# Altium project MB1280.PrjPCB
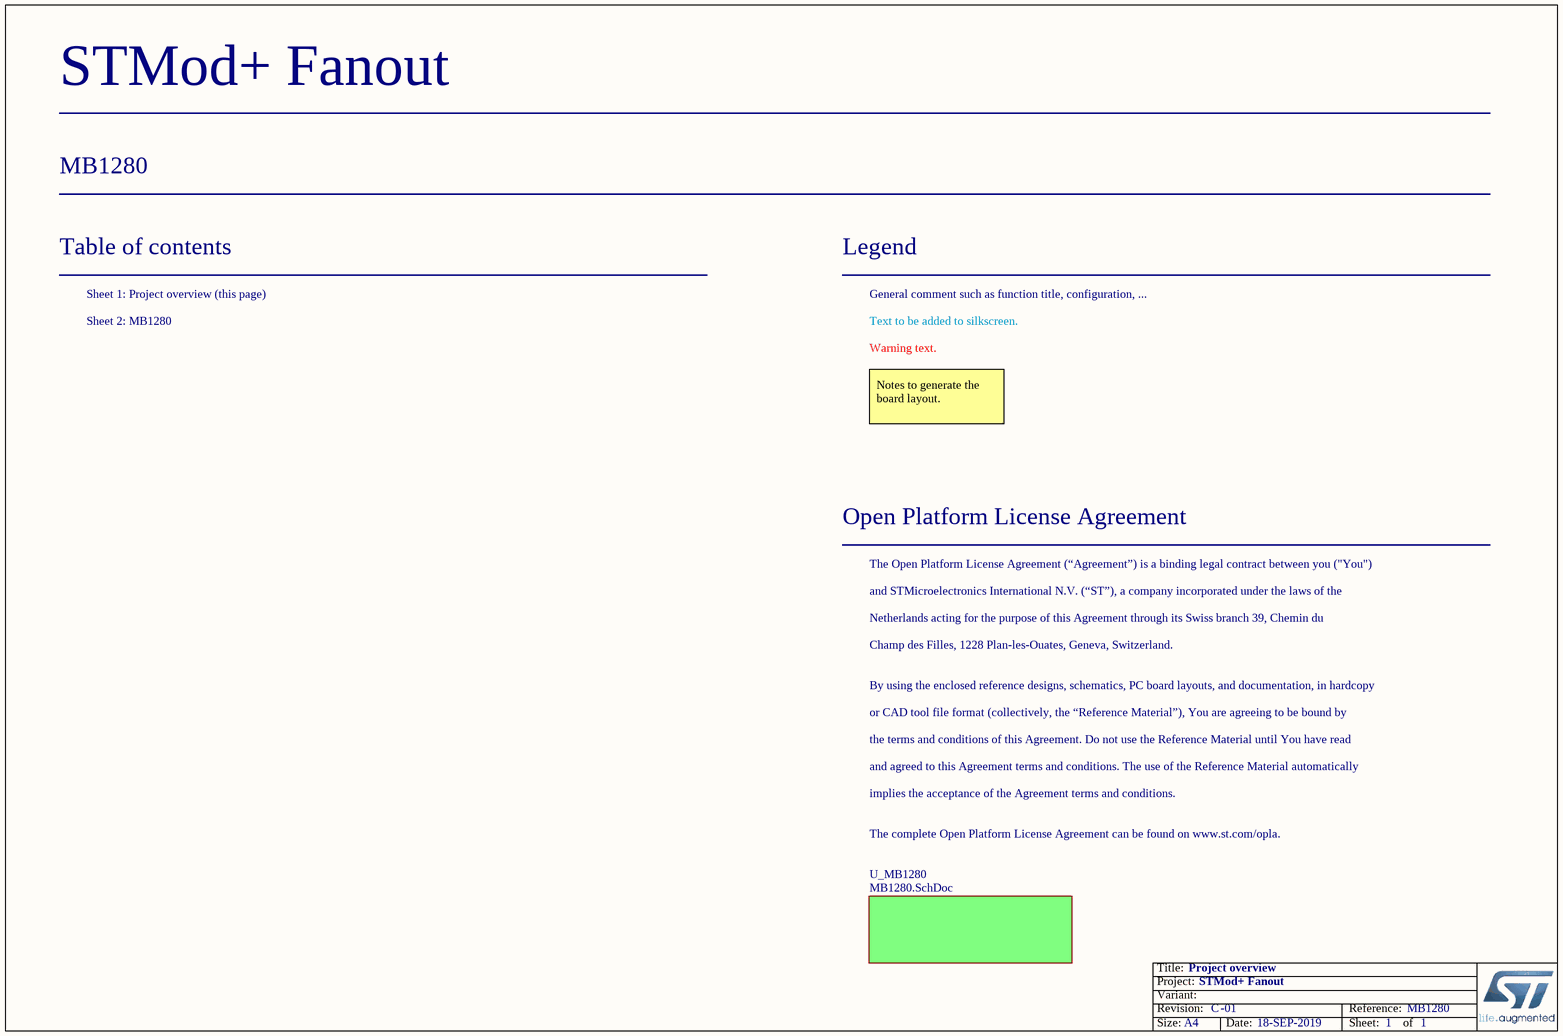
[diagram p0: Project_Overview.SchDoc]
Board_Assembly_Revision: 01; Board_Document_Date: 18-SEP-2019; Board_Name: STMod+ Fanout; Board_PCB_Revision: C; Board_Reference: MB1280
2 sheets, 28 parts. Net scope: global (net labels, ports and power ports of the same name join across sheets).
Board file: MB1280.PcbDoc
Sheets:
  Project_Overview.SchDoc
    U_MB1280 = MB1280.SchDoc

## Sheet Project_Overview.SchDoc: Project overview
size A4; Date: Not used; ApprovedBy: Not used; CheckedBy: Not used; Author: Not used; CompanyName: STMicroelectronics; DrawnBy: Not used; Engineer: Not used; Organization: Not used; Address1: Not used; Address2: Not used; Address3: Not used; Address4: Not used; DocumentNumber: Not used; Revision: Not used; SheetNumber: 1; SheetTotal: 1; CurrentTime: Not used; CurrentDate: Not used; Time: Not used; DocumentFullPathAndName: Not used; DocumentName: Not used; ModifiedDate: Not used; ImagePath: Not used; ProjectName: Not used; Application_BuildNumber: Not used

### Sub-sheets
U_MB1280 = MB1280.SchDoc: no entries

### Notes on the sheet
- Table of contents
- Sheet 1: Project overview (this page)
- Legend
- General comment such as function title, configuration, ...
- Sheet 2: MB1280
- Text to be added to silkscreen.
- Warning text.
- Notes to generate the board layout.
- Open Platform License Agreement
- The Open Platform License Agreement (“Agreement”) is a binding legal contract between you ("You")
- and STMicroelectronics International N.V. (“ST”), a company incorporated under the laws of the
- Netherlands acting for the purpose of this Agreement through its Swiss branch 39, Chemin du
- Champ des Filles, 1228 Plan-les-Ouates, Geneva, Switzerland.
- By using the enclosed reference designs, schematics, PC board layouts, and documentation, in hardcopy
- or CAD tool file format (collectively, the “Reference Material”), You are agreeing to be bound by
- the terms and conditions of this Agreement. Do not use the Reference Material until You have read
- and agreed to this Agreement terms and conditions. The use of the Reference Material automatically
- implies the acceptance of the Agreement terms and conditions.
- The complete Open Platform License Agreement can be found on www.st.com/opla.
- Title:
- Project:
- Size:
- Revision:
- Variant:
- A4
- -
- Date:
- Reference:
- Sheet:
- of

## Sheet MB1280.SchDoc: MB1280
size A4; Project: STM32H7-DK-DB; Date: Not used; ApprovedBy: Not used; CheckedBy: Not used; Author: Not used; CompanyName: STMicroelectronics; DrawnBy: Not used; Engineer: Not used; Organization: Not used; Address1: Not used; Address2: Not used; Address3: Not used; Address4: Not used; DocumentNumber: Not used; Revision: Not used; SheetNumber: 1; SheetTotal: 1; CurrentTime: Not used; CurrentDate: Not used; Time: Not used; DocumentFullPathAndName: Not used; DocumentName: Not used; ModifiedDate: Not used; ImagePath: Not used; ProjectName: Not used; Application_BuildNumber: Not used
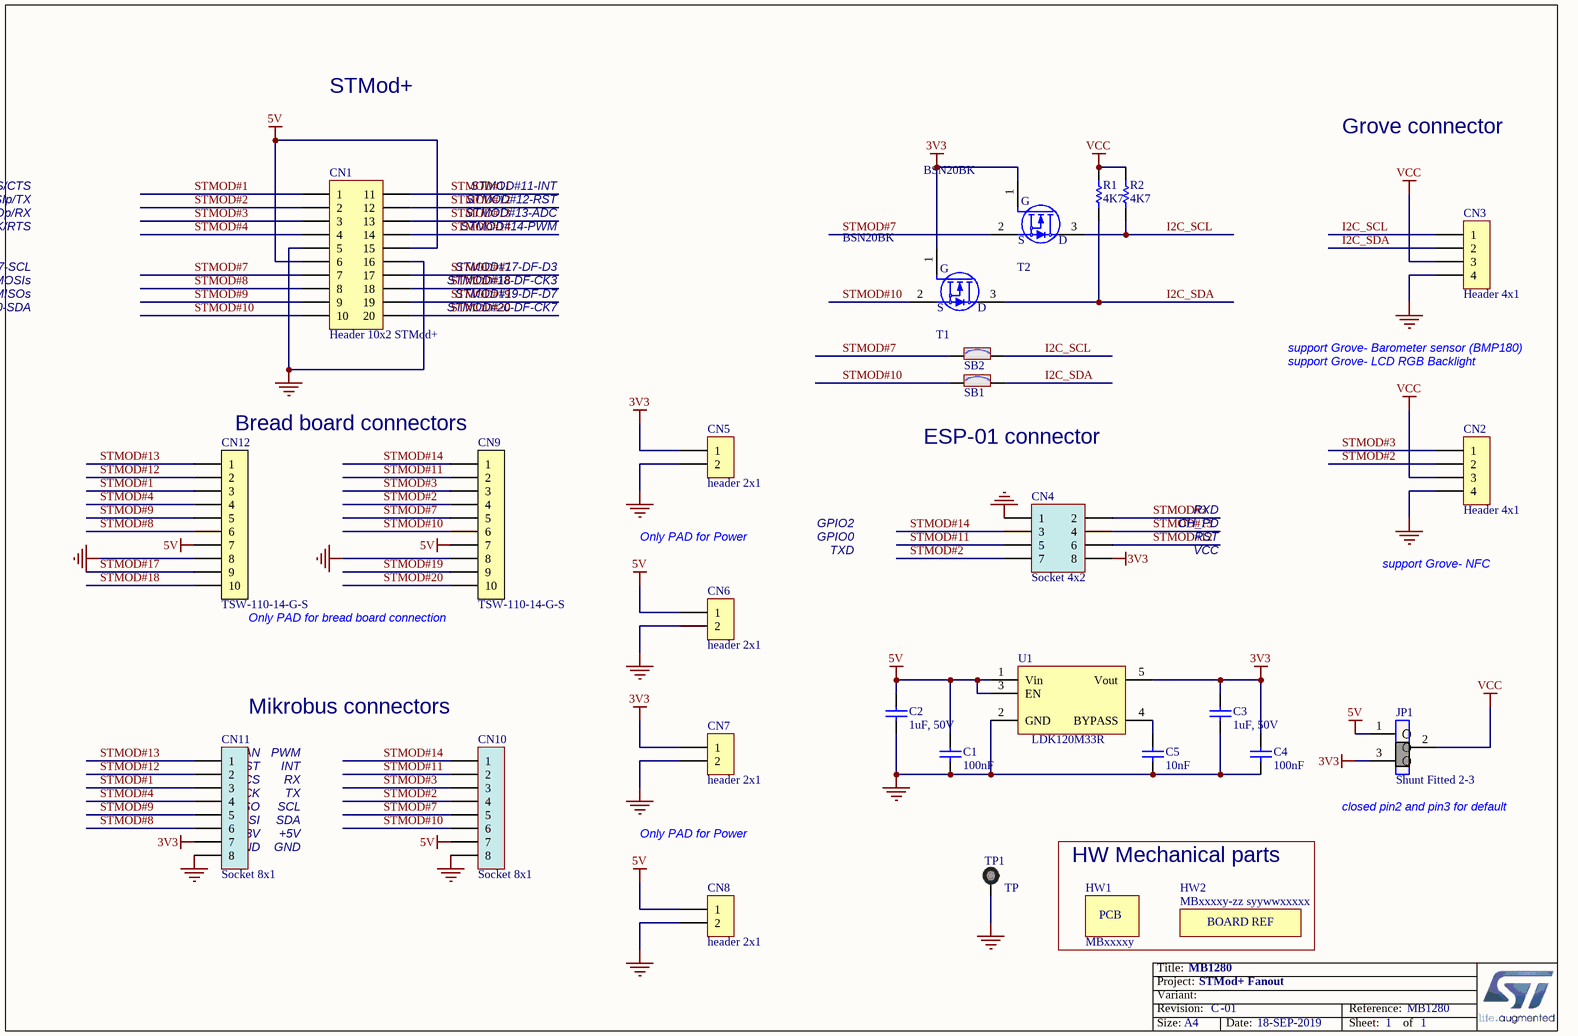
[diagram p1: MB1280.SchDoc]

### Parts
C1  value 100nF  [C0603]  (hidden comment: Capacitor)
C2  value 1uF, 50V  [C0603_H0P8]  (hidden comment: Capacitor)
C3  value 1uF, 50V  [C0603_H0P8]  (hidden comment: Capacitor)
C4  value 100nF  [C0603]  (hidden comment: Capacitor)
C5  value 10nF  [C0603]  (hidden comment: Capacitor)
CN1  Header 10x2 STMod+  [CON_SAMTEC_TMM-110-01-L-D-RA__STMOD+]
CN2  Header 4x1  [CON_988-JIUBABA_A2006LF-04A]
CN3  Header 4x1  [CON_988-JIUBABA_A2006LF-04A]
CN4  Socket 4x2  [CON_SAMTEC_SSW-104-01-X-D]
CN5  Header 2x1  [CON_988-JIUBABA_PHFS25-11-02-G0B115-T-1]
CN6  Header 2x1  [CON_988-JIUBABA_PHFS25-11-02-G0B115-T-1]
CN7  Header 2x1  [CON_988-JIUBABA_PHFS25-11-02-G0B115-T-1]
CN8  Header 2x1  [CON_988-JIUBABA_PHFS25-11-02-G0B115-T-1]
CN9  value TSW-110-14-G-S  [CON_SAMTEC_TSW-110-14-G-S]  (hidden comment: Header 10x1)
CN10  Socket 8x1  [CON_SAMTEC_SSW-108-01-X-S]
CN11  Socket 8x1  [CON_SAMTEC_SSW-108-01-X-S]
CN12  value TSW-110-14-G-S  [CON_SAMTEC_TSW-110-14-G-S]  (hidden comment: Header 10x1)
HW1  value MBxxxxy  (hidden comment: PCB)  (mechanical)
HW2  value MBxxxxy-zz syywwxxxxx  [STICKER_25X9]  (hidden comment: STICKER_BOARD_REF)  (no BOM)
JP1  value Shunt Fitted 2-3  [CON_SAMTEC_TSW-103-07-F-S]  (hidden comment: Jumper_Header 3x1 Fitted 2-3)
R1  value 4K7  [R0603]  (hidden comment: Resistor)
R2  value 4K7  [R0603]  (hidden comment: Resistor)
SB1  SB_ON  [SOLDER-BRIDGE_R0603-0R]  (value not drawn)
SB2  SB_ON  [SOLDER-BRIDGE_R0603-0R]  (value not drawn)
T1  value BSN20BK  [MOS_SOT23]  (hidden comment: BSN20)
T2  value BSN20BK  [MOS_SOT23]  (hidden comment: BSN20)
TP1  value TP  [TP_PTH_1MM_2MM]  (hidden comment: Test_Point_PTH_1mm_2mm)  (no BOM)
U1  LDK120M33R  [REG_SOT23-5L]

### Blocks framed on the sheet
HW Mechanical parts: HW1 HW2

### Nets
3V3: C3.2 C4.2 CN4.8 CN5.1 CN7.1 CN11.7 JP1.3 T1.1(G) T2.1(G) U1.5(Vout)
5V: C1.2 C2.2 CN1.6 CN1.15 CN6.1 CN8.1 CN9.7 CN10.7 CN12.7 JP1.1 U1.1(Vin) U1.3(EN)
GND: C1.1 C2.1 C3.1 C4.1 C5.1 CN1.5 CN1.16 CN2.4 CN3.4 CN4.1 CN5.2 CN6.2 CN7.2 CN8.2 CN9.8 CN10.8 CN11.8 CN12.8 TP1.1 U1.2(GND)
VCC: CN2.3 CN3.3 JP1.2 R1.1 R2.1
I2C_SCL: CN3.1 R2.2 SB2.2 T2.3(D)
I2C_SDA: CN3.2 R1.2 SB1.2 T1.3(D)
STMOD#1: CN1.1 CN11.3 CN12.3
STMOD#2: CN1.2 CN2.2 CN4.7 CN9.4 CN10.4
STMOD#3: CN1.3 CN2.1 CN4.2 CN9.3 CN10.3
STMOD#4: CN1.4 CN11.4 CN12.4
STMOD#7: CN1.7 CN9.5 CN10.5 SB2.1 T2.2(S)
STMOD#8: CN1.8 CN11.6 CN12.6
STMOD#9: CN1.9 CN11.5 CN12.5
STMOD#10: CN1.10 CN9.6 CN10.6 SB1.1 T1.2(S)
STMOD#11: CN1.11 CN4.5 CN9.2 CN10.2
STMOD#12: CN1.12 CN4.6 CN11.2 CN12.2
STMOD#13: CN1.13 CN4.4 CN11.1 CN12.1
STMOD#14: CN1.14 CN4.3 CN9.1 CN10.1
STMOD#17: CN1.17 CN12.9
STMOD#18: CN1.18 CN12.10
STMOD#19: CN1.19 CN9.9
STMOD#20: CN1.20 CN9.10
NetC5_2: C5.2 U1.4(BYPASS)

### Notes on the sheet
- STMod+
- Grove connector
- STMOD#1-NSS/CTS
- STMOD#2-MOSIp/TX
- STMOD#3-MISOp/RX
- STMOD#4-SCK/RTS
- STMOD#11-INT
- STMOD#12-RST
- STMOD#13-ADC
- STMOD#14-PWM
- (near CN3) SCL
- (near CN3) SDA
- STMOD#7-SCL
- STMOD#8-MOSIs
- STMOD#9-MISOs
- STMOD#10-SDA
- STMOD#17-DF-D3
- STMOD#18-DF-CK3
- STMOD#19-DF-D7
- STMOD#20-DF-CK7
- support Grove- Barometer sensor (BMP180)
- support Grove- LCD RGB Backlight
- Bread board connectors
- ESP-01 connector
- (near CN2) RX
- RXD
- (near CN2) TX
- Only PAD for Power
- GPIO2
- GPIO0
- TXD
- CH_PD
- RST
- VCC
- support Grove- NFC
- Only PAD for bread board connection
- Mikrobus connectors
- (near CN11) AN
- (near CN11) RST
- (near CN11) CS
- PWM
- INT
- RX
- (near CN11) SCK
- (near CN11) MISO
- (near CN11) MOSI
- (near CN11) +3.3V
- (near CN11) GND
- TX
- SCL
- SDA
- +5V
- GND
- (near JP1) closed pin2 and pin3 for default
- Title:
- Project:
- Size:
- Revision:
- Variant:
- A4
- -
- Date:
- Reference:
- Sheet:
- of
- (in symbol MCD-00235) BOARD REF

### Library data of the parts
C1 C4 = MCD-00211: Capacitor, MLCC, 100nF, 16V, X7R, 10%, 0603, T=0,8mm; Manufacturer_Part_Number: CC0603KRX7R7BB104; Manufacturer: YAGEO; Provided_By: SUBCO; ECCN_US: EAR99; ECCN_EU: NEC; Internal_Part_Number: MCD-00211; Status: Released; Part_Type: Capacitor; Package: C0603; ComponentLink1Description: Datasheet; ComponentLink1URL: http://tunmcdsvn.tun.st.com/Component_Datasheet_Library/Trunk/Capacitors/Yageo_Multilayer_Capacitor_X7R_series_100pF_to_22uF
C2 C3 = MCD-01703: Capacitor,1uF,50V,X5R,10%,0603, T=0.8mm; Manufacturer_Part_Number: CC0603KRX5R9BB105; Manufacturer: YAGEO; Provided_By: SUBCO; Internal_Part_Number: MCD-01703; Status: Released; Part_Type: Capacitor; Package: C0603; ComponentLink1Description: Datasheet; ComponentLink1URL: http://tunmcdsvn.tun.st.com/Component_Datasheet_Library/Trunk/Capacitors/Yageo_Multilayer_capacitor_X5R_series_100pF_to_100uF/YAGEO_MLCC_UPY-GPHC_X5R_4V-to-50V_25.pdf; ECCN_US: N/A; ECCN_EU: N/A
C5 = MCD-00017: Capacitor, MLCC, 10nF, 50V, X7R, 10%, 0603, T=0.8mm; Manufacturer_Part_Number: CC0603KRX7R9BB103; Manufacturer: YAGEO; Provided_By: SUBCO; ECCN_US: EAR99; ECCN_EU: NEC; Internal_Part_Number: MCD-00017; Status: Released; Part_Type: Capacitor; Package: C0603; ComponentLink1Description: Datasheet; ComponentLink1URL: http://tunmcdsvn.tun.st.com/Component_Datasheet_Library/Trunk/Capacitors/Yageo_Multilayer_Capacitor_X7R_series_100pF_to_22uF
CN1 = MCD-00288: Header 10x2, 2mm, RA, TH, Height 3.20mm/3.50mm; Part_Type: Connector; Manufacturer_Part_Number: TMM-110-01-L-D-RA; Manufacturer: SAMTEC; Alternate_Manufacturer_Part_Number: PH200210C-07000; Alternate_Manufacturer: JIUBABA; Provided_By: SUBCO; Internal_Part_Number: MCD-00288; Value: Header 10x2 STMod+; Status: Released; ComponentLink1Description: Datasheet; ComponentLink1URL: http://tunmcdsvn.tun.st.com/Component_Datasheet_Library/Trunk/Connectors/Samtec_tmm_th_series; ECCN_US: n/a; ECCN_EU: n/a
CN2 CN3 = MCD-01741: Header 4x1, 2mm, VR, SMT; Part_Type: Connector; Manufacturer_Part_Number: A2006LF-04A; Manufacturer: Jiubaba; Provided_By: SUBCO; Internal_Part_Number: MCD-01741; Value: Header 4x1; Status: Released; ComponentLink1Description: Datasheet; ComponentLink1URL: http://tunmcdsvn.tun.st.com/Component_Datasheet_Library/Trunk/Connectors/Jiubaba_A2006LF-0xA/988_A2006LF-0xA.pdf; ECCN_US: N/A; ECCN_EU: N/A
CN4 = MCD-01742: Socket 4x2,2.54mm,VR,TH, height 8.51/2.64mm; Part_Type: Connector; Manufacturer_Part_Number: SSW-104-01-G-D; Manufacturer: SAMTEC; Alternate_Manufacturer_Part_Number: 218108S1610; Alternate_Manufacturer: Jiubaba; Provided_By: SUBCO; Internal_Part_Number: MCD-01742; Value: Socket 4x2; Status: Released; ComponentLink1Description: Datasheet; ComponentLink1URL: http://tunmcdsvn.tun.st.com/Component_Datasheet_Library/Trunk/Connectors/Samtec_SSW-SSQ-series/Samtec_SSW-SSQ-series.pdf; ECCN_US: N/A; ECCN_EU: N/A
CN5-CN8 = MCD-00314: Header, 2x1, 2.54mm, VR, TH, Height 6mm/3mm; Part_Type: Connector; Manufacturer_Part_Number: PHFS25-11-02-G0B115-T-1; Manufacturer: JIUBABA; Provided_By: SUBCO; Internal_Part_Number: MCD-00314; Value: header 2x1; Status: Released; ComponentLink1Description: Datasheet; ComponentLink1URL: http://tunmcdsvn.tun.st.com/Component_Datasheet_Library/Trunk/Connectors/Jiubaba_PHFS25_11XXXXXXXXXX; ECCN_US: n/a; ECCN_EU: n/a
CN9 CN12 = MCD-01591: Header 10x1, 2,54mm height  10.67mm; Part_Type: Connector; Manufacturer: SAMTEC; Provided_By: SUBCO; Internal_Part_Number: MCD-01591; Status: Footprint available; Manufacturer_Part_Number: TSW-110-14-G-S; ComponentLink1Description: Datasheet; ComponentLink1URL: http://tunmcdsvn.tun.st.com/Component_Datasheet_Library/Trunk/Connectors/Samtec_TSW-HTSW-series/Samtec_TSW-HTSW-series.pdf; ECCN_US: n/a; ECCN_EU: n/a
CN10 CN11 = MCD-01743: Socket 8x1, 2.54mm, VR, TH, height 8.51/2.64mm; Part_Type: Connector; Manufacturer_Part_Number: SSW-108-01-x-S; Manufacturer: SAMTEC; Alternate_Manufacturer_Part_Number: FH25404D-14000; Alternate_Manufacturer: Jiubaba; Provided_By: SUBCO; Internal_Part_Number: MCD-01743; Value: Socket 8x1; Status: Released; ComponentLink1Description: Datasheet; ComponentLink1URL: http://tunmcdsvn.tun.st.com/Component_Datasheet_Library/Trunk/Connectors/Samtec_SSW-SSQ-series/Samtec_SSW-SSQ-series.pdf; ECCN_US: N/A; ECCN_EU: N/A
HW1 = MCD-00216: PCB, xxxx for PCB number, Y for PCB revision; Part_Type: Mechanical; Provided_By: SUBCO; Internal_Part_Number: MCD-00216; Status: Released; Manufacturer_Part_Number: n/a; Manufacturer: n/a; ComponentLink1Description: Datasheet; ECCN_US: n/a; ECCN_EU: n/a
HW2 = MCD-00235: Sticker to mention board reference + serial number; Part_Type: Mechanical; Provided_By: SUBCO; Internal_Part_Number: MCD-00235; Status: Released; Manufacturer_Part_Number: n/a; Manufacturer: n/a; ComponentLink1Description: Datasheet; ComponentLink1URL: n/a; ECCN_US: n/a; ECCN_EU: n/a
JP1 = MCD-00685: Header, 3x1, 2,54mm, VR, TH, Height 5.84mm/2.54mm - Shunt Fitted 2-3 by default; Part_Type: Connector; Manufacturer_Part_Number: TSW-103-07-F-S; Manufacturer: SAMTEC; Provided_By: SUBCO; Internal_Part_Number: MCD-00685; Status: Released; ComponentLink1Description: Datasheet; ComponentLink1URL: http://tunmcdsvn.tun.st.com/Component_Datasheet_Library/Trunk/Connectors/Samtec_TSW-HTSW-series; ECCN_US: n/a; ECCN_EU: n/a
R1 R2 = MCD-00219: Resistor,4K7,0603,1%,1/10W; Manufacturer_Part_Number: RC0603FR-074K7L; Manufacturer: YAGEO; Provided_By: SUBCO; ECCN_US: EAR99; ECCN_EU: NEC; Internal_Part_Number: MCD-00219; Status: Released; Part_Type: Resistor; Package: R0603; ComponentLink1Description: Datasheet; ComponentLink1URL: http://tunmcdsvn.tun.st.com/Component_Datasheet_Library/Trunk/Resistors/Yageo_Resistor_RC0603-series
SB1 SB2 = MCD-00071: Solder Bridge ON; Part_Type: Mechanical; Manufacturer_Part_Number: RC0603JR-070RL; Manufacturer: YAGEO; Provided_By: SUBCO; Internal_Part_Number: MCD-00071; Status: Released; Package: SB0603; ComponentLink1Description: Datasheet; ComponentLink1URL: http://tunmcdsvn.tun.st.com/Component_Datasheet_Library/Trunk/Resistors/Yageo_Resistor_RC0603-series; ECCN_US: n/a; ECCN_EU: n/a
T1 T2 = MCD-01969: N-channel enhancement mode field-effect transistor; Manufacturer: Nexperia; Provided_By: SUBCO; ECCN_US: EAR99; ECCN_EU: NEC; Internal_Part_Number: MCD-01969; Status: Checked; Part_Type: Transistor; Manufacturer_Part_Number: BSN20BK; ComponentLink1Description: Datasheet; ComponentLink1URL: http://tunmcdsvn.tun.st.com/Component_Datasheet_Library/Trunk/IC/NXP_Transistor_BSN20BK_SOT23; Package: BSN20BK
TP1 = MCD-01506: Test Point trought hole 1mm/2mm; Part_Type: Mechanical; Internal_Part_Number: MCD-01506; Status: Released; Manufacturer_Part_Number: N/A; Manufacturer: N/A; ComponentLink1Description: Datasheet; ComponentLink1URL: n/a; Provided_By: n/a; ECCN_US: n/a; ECCN_EU: n/a
U1 = MCD-00663: 200 mA low quiescent current very low noise LDO; Part_Type: IC; Manufacturer: STMICROELECTRONICS; BMS_Part_Number: 9176330; Provided_By: SUBCO with ST control; ECCN_US: EAR99; ECCN_EU: NEC; Internal_Part_Number: MCD-00663; Value: LDK120M33R; Status: Released; Manufacturer_Part_Number: LDK120M33R; Package: SOT23-5L; ComponentLink1Description: Datasheet; ComponentLink1URL: http://tunmcdsvn.tun.st.com/Component_Datasheet_Library/Trunk/IC/STM_LDO_LDK120M33R

## Assembly variants
3V3: not fitted CN5 CN6 CN7 CN8 CN9 CN12 R1 R2 T1 T2